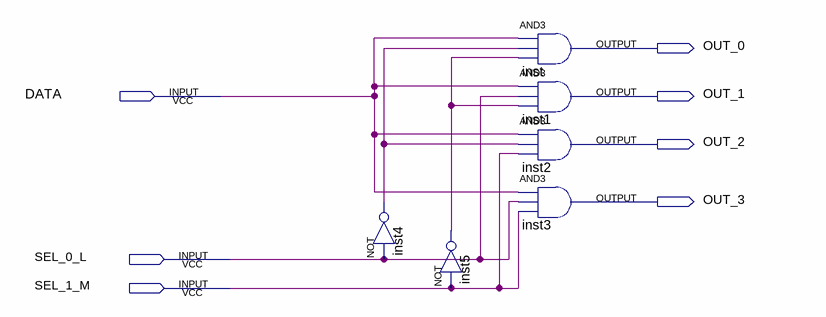
[diagram p0: schematic sheet]
// Quartus schematic de_mux.bdf as structural Verilog: 6 symbols, 7 pins
module de_mux (
  input  DATA,
  input  SEL_0_L,
  input  SEL_1_M,
  output OUT_0,
  output OUT_1,
  output OUT_2,
  output OUT_3
);

  wire inst4_out, inst5_out;

  not inst4 (inst4_out, SEL_0_L);
  not inst5 (inst5_out, SEL_1_M);
  and inst (OUT_0, DATA, inst4_out, inst5_out);
  and inst1 (OUT_1, DATA, SEL_0_L, inst5_out);
  and inst2 (OUT_2, DATA, inst4_out, SEL_1_M);
  and inst3 (OUT_3, DATA, SEL_0_L, SEL_1_M);
endmodule
